# Altium schematic sheet Sheet1.SchDoc
size A; SheetNumber: 1; SheetTotal: 1; SPICEModelCacheLUZIYKHY: <root> / <DocumentId>LUZIYKHY</DocumentId> / <CacheFrame Number="0"> / <Model Name="cap" Kind="MDL"> / <Text>*Default semiconductor capacitor / .MODEL CAP C()</Text> / </Model> / </CacheFrame> / </root>
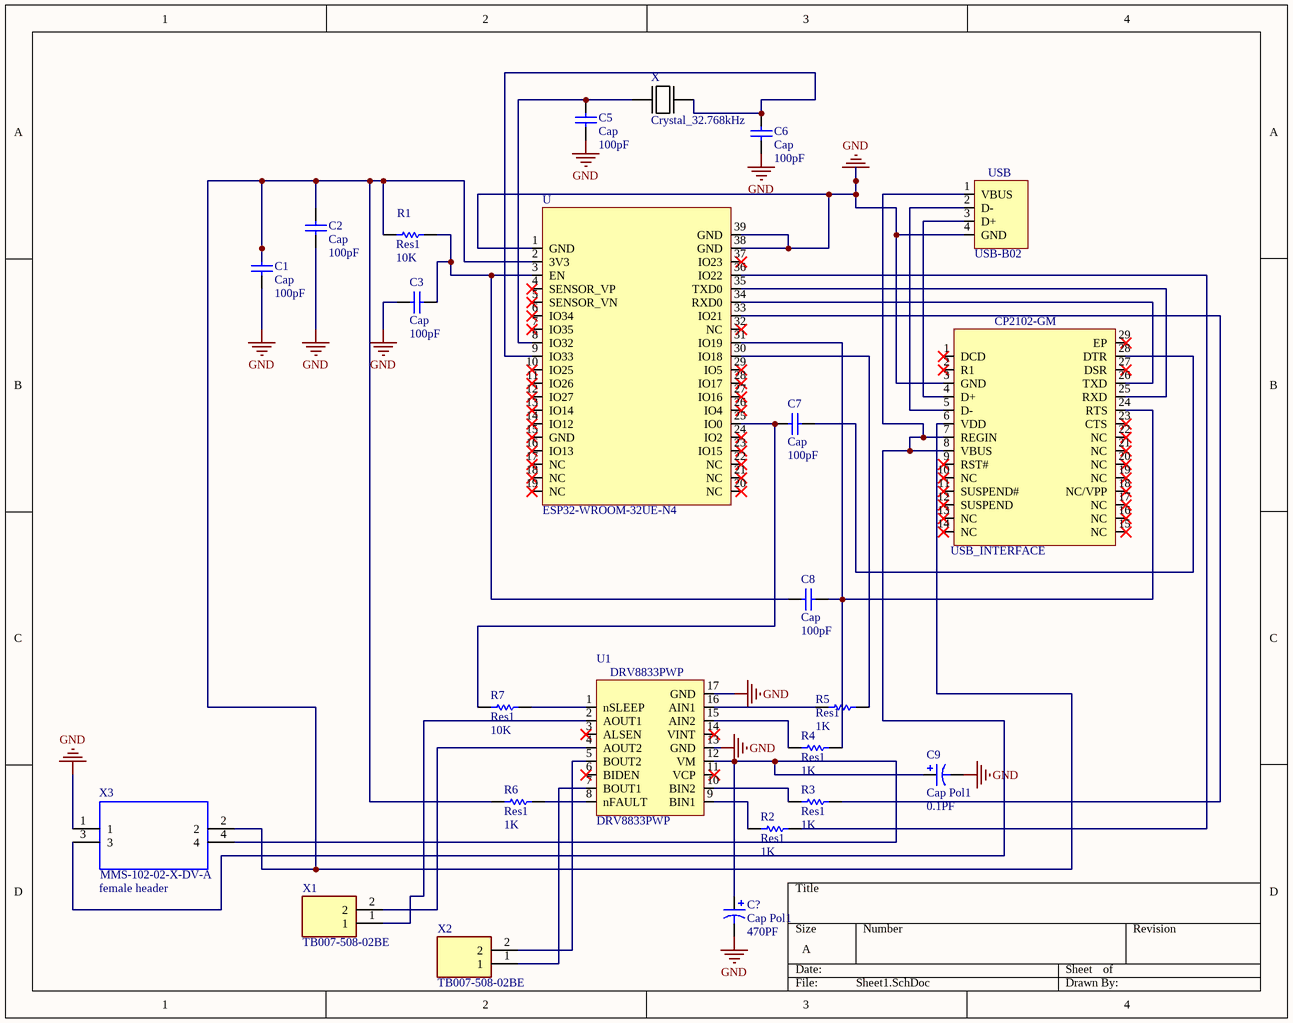
[diagram p0: Sheet1.SchDoc]

## Parts
?  USB-B02  [USB-A1HSW6]
C1  Cap  value 100pF  [RAD-0.3]
C2  Cap  value 100pF  [RAD-0.3]
C3  Cap  value 100pF  [RAD-0.3]
C5  Cap  value 100pF  [RAD-0.3]
C6  Cap  value 100pF  [RAD-0.3]
C7  Cap  value 100pF  [RAD-0.3]
C8  Cap  value 100pF  [RAD-0.3]
C9  Cap Pol1  value 0.1PF  [RB7.6-15]
C?  Cap Pol1  value 470PF  [RB7.6-15]
R1  Res1  value 10K  [AXIAL-0.3]
R2  Res1  value 1K  [AXIAL-0.3]
R3  Res1  value 1K  [AXIAL-0.3]
R4  Res1  value 1K  [AXIAL-0.3]
R5  Res1  value 1K  [AXIAL-0.3]
R6  Res1  value 1K  [AXIAL-0.3]
R7  Res1  value 10K  [AXIAL-0.3]
U  ESP32-WROOM-32UE-N4
U1  DRV8833PWP
USB_INTERFACE  (no value)
X  Crystal_32.768kHz
X1  TB007-508-02BE  [CUI_TB007-508-02BE]
X2  TB007-508-02BE  [CUI_TB007-508-02BE]
X3  female header  [female header]

## Nets
GND: ?.4(GND) C1.1 C2.1 C3.1 C5.2 C6.1 C9.2 C?.2 U.1(GND) U.38(GND) U.39(GND) U1.13(GND) U1.17(GND) USB_INTERFACE.3(GND) X3.1
Net?_1: ?.1(VBUS) USB_INTERFACE.7(REGIN) USB_INTERFACE.8(VBUS) X3.3
Net?_2: ?.2(D-) USB_INTERFACE.5(D-)
Net?_3: ?.3(D+) USB_INTERFACE.4(D+)
NetC1_2: C1.2 C2.2 R1.1 R6.1 U.2(3V3) USB_INTERFACE.6(VDD) X3.2
NetC3_2: C3.2 C8.1 R1.2 U.3(EN)
NetC5_1: C5.1 U.8(IO32) X.?2
NetC6_2: C6.2 U.9(IO33) X.?1
NetC7_1: C7.1 R7.1 U.25(IO0)
NetC7_2: C7.2 USB_INTERFACE.28(DTR)
NetC8_2: C8.2 R4.2 U.31(IO19) USB_INTERFACE.24(RTS)
NetC9_1: C9.1 C?.1 U1.12(VM) X3.4
NetR2_1: R2.1 U1.9(BIN1)
NetR2_2: R2.2 U.36(IO22)
NetR3_1: R3.1 U1.10(BIN2)
NetR3_2: R3.2 U.33(IO21)
NetR4_1: R4.1 U1.15(AIN2)
NetR5_1: R5.1 U1.16(AIN1)
NetR5_2: R5.2 U.30(IO18)
NetR6_2: R6.2 U1.8(nFAULT)
NetR7_2: R7.2 U1.1(nSLEEP)
NetU1_2: U1.2(AOUT1) X1.1
NetU1_4: U1.4(AOUT2) X1.2
NetU1_5: U1.5(BOUT2) X2.2
NetU1_7: U1.7(BOUT1) X2.1
NetU_34: U.34(RXD0) USB_INTERFACE.26(TXD)
NetU_35: U.35(TXD0) USB_INTERFACE.25(RXD)

Not connected (* = marked no-connect by the designer): U 4(SENSOR_VP)* 5(SENSOR_VN)* 6(IO34)* 7(IO35)* 10(IO25)* 11(IO26)* 12(IO27)* 13(IO14)* 14(IO12)* 15(GND)* 16(IO13)* 17(NC)* 18(NC)* 19(NC)* 20(NC)* 21(NC)* 22(NC)* 23(IO15)* 24(IO2)* 26(IO4)* 27(IO16)* 28(IO17)* 29(IO5)* 32(NC)* 37(IO23)*; U1 3(ALSEN)* 6(BIDEN)* 11(VCP)* 14(VINT)*; USB_INTERFACE 1(DCD)* 2(R1)* 9(RST#)* 10(NC)* 11(SUSPEND#)* 12(SUSPEND)* 13(NC)* 14(NC)* 15(NC)* 16(NC)* 17(NC)* 18(NC/VPP)* 19(NC)* 20(NC)* 21(NC)* 22(NC)* 23(CTS)* 27(DSR)* 29(EP)*

## Notes on the sheet
- (in symbol female header) MMS-102-02-X-DV-A
- (in symbol USB-B02) USB

## Library data of the parts
? = USB-B02: RF Connectors / Coaxial Connectors
C1-C3 C5-C8 = Cap: Capacitor; Published: 8-Jun-2000; LatestRevisionDate: 17-Jul-2002; LatestRevisionNote: Re-released for DXP Platform.; PackageReference: RAD-0.3; Publisher: Altium Limited; PackageDescription: Radial Cap, Thru-Hole; 2 Leads; 0.3 in Pin Spacing
C9 C? = Cap Pol1: Polarized Capacitor (Radial); Published: 8-Jun-2000; LatestRevisionDate: 17-Jul-2002; LatestRevisionNote: Re-released for DXP Platform.; PackageReference: RB7.6-15; Publisher: Altium Limited; PackageDescription: Polarized Capacitor (Radial); 2 Leads
R1-R7 = Res1: Resistor; Published: 8-Jun-2000; LatestRevisionDate: 17-Jul-2002; LatestRevisionNote: Re-released for DXP Platform.; PackageReference: AXIAL-0.3; Publisher: Altium Limited; PackageDescription: Axial Device, Thru-Hole; 2 Leads; 0.3 in Pin Spacing
U = ESP32-WROOM-32UE-N4: Multiprotocol Modules SMD module ESP32-WROOM-32UE, ESP32-D0WD-V3, ESP32 ECO V3, 4 MB SPI flash, IPEX antenna connector
U1 = DRV8833PWP: Motor/Motion/Ignition Controllers & Drivers 2A LO VLTG BIPOLAR S TEPPER MOTOR DRIVER A 595-DRV8833PWPR
USB_INTERFACE = CP2102-GM: USB Interface IC USB to UART Bridge QFN28